# Altium schematic sheet ControllerSupplySwitch.SchDoc
size A4
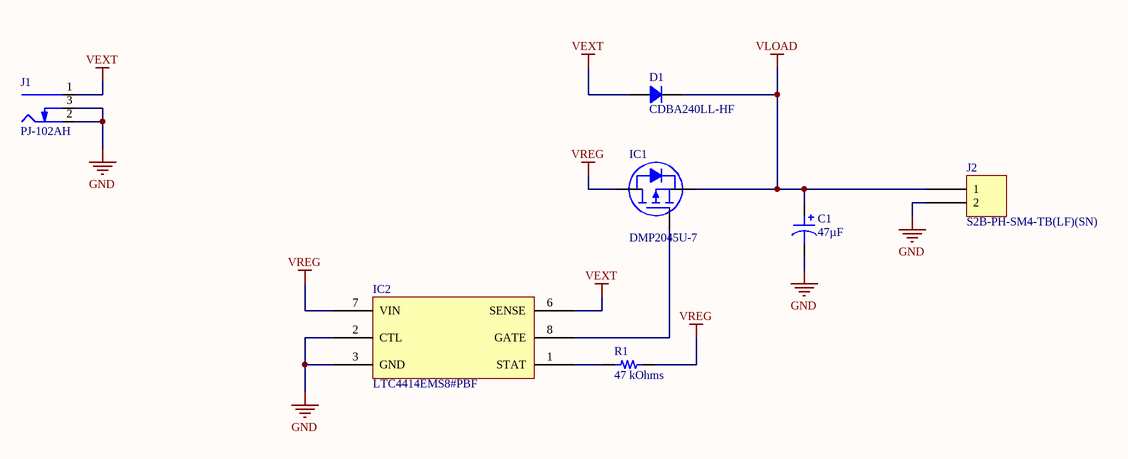
[diagram p0: ControllerSupplySwitch.SchDoc]

## Parts
C1  47µF  [CAP ALSMD 6.6MM H6.1MM]
D1  CDBA240LL-HF  [DO214AC SMA]
IC1  DMP2045U-7  [DIODES SOT-23-3]
IC2  LTC4414EMS8#PBF  [ANALOG MSOP-8 RM-8]
J1  PJ-102AH  [CUI PJ-102AH]
J2  S2B-PH-SM4-TB(LF)(SN)  [JST S2B-PH-SM4-TB]
R1  47 kOhms  [RES 0603_1608]

## Nets
GND: C1.2 IC2.2(CTL) IC2.3(GND) J1.2(Outer) J1.3(SW) J2.2
VEXT: D1.1 IC2.6(SENSE) J1.1(Centre)
VLOAD: C1.1 D1.2 IC1.2(S) J2.1
VREG: IC1.3(D) IC2.7(VIN) R1.2
NetIC1_1: IC1.1(G) IC2.8(GATE)
NetIC2_1: IC2.1(STAT) R1.1

## Notes on the sheet
- Title
- Size:
- Date:
- A4
- Number:
- Time:
- Revision:
- Sheet
- of
- File:

## Library data of the parts
C1 = HHXD250ARA470MF61G: ALUMINUM CAPACITOR; Manufacturer: United Chemi-Con; ESR (Equivalent Series Resistance): 50mOhm; Lifetime @ Temp.: 5000 Hrs @ 105°C; Ripple Current @ High Frequency: 1.3A @ 100kHz; Ripple Current @ Low Frequency: 130mA @ 120Hz; Surface Mount Land Size: 0.260" L x 0.260" W (6.60mm x 6.60mm); Tolerance: ±20%; Type: Hybrid; Voltage - Rated: 25V; Part Number: HHXD250ARA470MF61G; Applications: Automotive; Capacitance: 47µF; ComponentLink1Description: Datasheet; ComponentLink1URL: http://www.chemi-con.co.jp/cgi-bin/CAT_DB/SEARCH/cat_db_al.cgi?e=e&j=p&pdfname=hxd; ComponentLink2Description: DigiKey Link; ComponentLink2URL: http://digikey.com/product-detail/en/united-chemi-con/HHXD250ARA470MF61G/565-HHXD250ARA470MF61GCT-ND/10487166; Device Package: Radial, Can - SMD; Height - Seated (Max): 0.240" (6.10mm); LastUpdated: 21/01/2020 04:05:20; Lifecycle Status: Active; Minimum Order: 1; Mounting Type: Surface Mount; Operating Temperature: -55°C ~ 105°C; Package / Case: Radial, Can - SMD; Packaging: TapeAndReel; PartId: 2188; Part Status: Active; Price: 0.19; Ratings: AEC-Q200; Series: HXD; Size / Dimension: 0.248" Dia (6.30mm); Supplier 1: DigiKey; Supplier Part Number 1: 565-HHXD250ARA470MF61GCT-ND; Value: 47µF
D1 = CDBA240LL-HF: DIODE SCHOTTKY 40V 2A DO214AC; Manufacturer: Comchip Technology; Capacitance @ Vr, F: 160pF @ 4V, 1MHz; Current - Average Rectified (Io): 2A (DC); Current - Reverse Leakage @ Vr: 1mA @ 40V; Speed: Fast Recovery =< 500ns, > 200mA (Io); Voltage - Forward (Vf) (Max) @ If: 350mV @ 2A; Part Number: CDBA240LL-HF; ComponentLink1Description: Datasheet; ComponentLink1URL: http://www.comchiptech.com/admin/files/product/CDBA240LL-HF RevC514247.pdf; ComponentLink2Description: DigiKey Link; ComponentLink2URL: http://digikey.com/product-detail/en/comchip-technology/CDBA240LL-HF/641-1698-1-ND/5226081; Device Package: DO-214AC, SMA; Diode Type: Schottky; LastUpdated: 02/02/2020 10:17:39; Lifecycle Status: Active; Minimum Order: 1; Mounting Type: Surface Mount; Operating Temperature - Junction: -55°C ~ 100°C; Package / Case: DO-214AC, SMA; Packaging: TapeAndReel; PartId: 2082; Part Status: Active; Price: 0.15; Series: -; Supplier 1: DigiKey; Supplier Part Number 1: 641-1698-1-ND; Supplier Device Package: DO-214AC (SMA); Voltage - DC Reverse (Vr) (Max): 40V
IC1 = DMP2045U-7: MOSFET P-CHAN 24V SOT23; Manufacturer: Diodes Incorporated; Current - Continuous Drain (Id) @ 25°C: 4.3A (Ta); Drain to Source Voltage (Vdss): 20V; Drive Voltage (Max Rds On,  Min Rds On): 1.8V, 4.5V; FET Type: P-Channel; Gate Charge (Qg) (Max) @ Vgs: 6.8nC @ 4.5V; Input Capacitance (Ciss) (Max) @ Vds: 634pF @ 10V; Power Dissipation (Max): 800mW (Ta); Rds On (Max) @ Id, Vgs: 45mOhm @ 4A, 4.5V; Vgs (Max): ±8V; Vgs(th) (Max) @ Id: 1V @ 250µA; Part Number: DMP2045U-7; ComponentLink1Description: Datasheet; ComponentLink1URL: https://www.diodes.com/assets/Datasheets/DMP2045U.pdf; ComponentLink2Description: DigiKey Link; ComponentLink2URL: http://digikey.com/product-detail/en/diodes-incorporated/DMP2045U-7/DMP2045U-7DICT-ND/8275359; Device Package: TO-236-3, SC-59, SOT-23-3; LastUpdated: 21/01/2020 04:00:36; Lifecycle Status: Active; Minimum Order: 1; Mounting Type: Surface Mount; Operating Temperature: -55°C ~ 150°C (TJ); Package / Case: TO-236-3, SC-59, SOT-23-3; Packaging: TapeAndReel; Part Status: Active; Price: 0.08; Series: -; Supplier 1: DigiKey; Supplier Part Number 1: DMP2045U-7DICT-ND; Supplier Device Package: SOT-23; Technology: MOSFET (Metal Oxide)
IC2 = LTC4414EMS8#PBF: IC OR CTRLR SRC SELECT 8MSOP; Manufacturer: Linear Technology/Analog Devices; Current - Supply: 33µA; Delay Time - OFF: 20µs; Delay Time - ON: 600µs; FET Type: P-Channel; Internal Switch(s): No; Ratio - Input:Output: 2:1; Voltage - Supply: 3V ~ 36V; Applications: Battery Backup, Industrial/Automotive, High Current Switch; ComponentLink1Description: Datasheet; ComponentLink1URL: http://www.linear.com/docs/9037; ComponentLink2Description: DigiKey Link; ComponentLink2URL: http://digikey.com/product-detail/en/linear-technology-analog-devices/LTC4414EMS8-PBF/LTC4414EMS8-PBF-ND/1620230; Device Package: 8-TSSOP, 8-MSOP (0.118", 3.00mm Width); LastUpdated: 02/02/2020 11:30:26; Lifecycle Status: Active; Part Number: LTC4414EMS8#PBF; Minimum Order: 1; Mounting Type: Surface Mount; Operating Temperature: -40°C ~ 85°C; Package / Case: 8-TSSOP, 8-MSOP (0.118", 3.00mm Width); Packaging: Tube; Part Status: Active; Price: 4.49; Series: PowerPath™; Supplier 1: DigiKey; Supplier Part Number 1: LTC4414EMS8#PBF-ND; Supplier Device Package: 8-MSOP; Type: Source Selector Switch
J1 = PJ-102AH: CONN PWR JACK 2X5.5MM SOLDER; Manufacturer: CUI Devices; Actual Diameter: 0.079" (2.00mm ID), 0.256" (6.50mm OD); Current Rating (Amps): 5A; Gender: Male; Industry Recognized Mating Diameter: 2.00mm ID (0.079"), 5.50mm OD (0.217"); Internal Switch(s): Single Switch, Normally Closed; Material Flammability Rating: UL94 V-0; Mating Length/Depth: 0.354" (9.00mm); Number of Positions/Contacts: 2 Conductors, 3 Contacts; Shielding: Unshielded; Voltage - Rated: 24VDC; Part Number: PJ-102AH; ComponentLink1Description: Datasheet; ComponentLink1URL: https://www.cuidevices.com/product/resource/digikeypdf/pj-102ah.pdf; ComponentLink2Description: DigiKey Link; ComponentLink2URL: //digikey.com/product-detail/en/cui-devices/PJ-102AH/CP-102AH-ND/408448; Connector Type: Jack; LastUpdated: 16/12/2019 19:01:27; Lifecycle Status: 0; Minimum Order: 1; Mounting Type: Through Hole, Right Angle; Packaging: Tray; Part Status: Active; Price: 0.76; Series: -; Supplier 1: DigiKey; Supplier Part Number 1: CP-102AH-ND; Termination: Solder
J2 = S2B-PH-SM4-TB(LF)(SN): CONN HEADER SMD R/A 2POS 2MM; Manufacturer: JST Sales America Inc.; Contact Length - Mating: 0.130" (3.30mm); Current Rating (Amps): 2A; Material Flammability Rating: UL94 V-0; Number of Positions: 2; Number of Positions Loaded: All; Pitch - Mating: 0.079" (2.00mm); Shrouding: Shrouded - 4 Wall; Style: Board to Cable/Wire; Voltage Rating: 100V; Part Number: S2B-PH-SM4-TB(LF)(SN); ComponentLink1Description: Datasheet; ComponentLink1URL: http://www.jst-mfg.com/product/pdf/eng/ePH.pdf; ComponentLink2Description: DigiKey Link; ComponentLink2URL: http://digikey.com/product-detail/en/jst-sales-america-inc/S2B-PH-SM4-TB-LF-SN/455-1749-1-ND/926846; Connector Type: Header; Contact Finish - Mating: Tin; Contact Finish - Post: Tin; Contact Material: Copper Alloy; Contact Shape: Square; Contact Type: Male Pin; Fastening Type: Detent Lock; Features: Solder Retention; Insulation Color: Natural; Insulation Height: 0.217" (5.51mm); Insulation Material: Polyamide (PA6T), Nylon 6T; LastUpdated: 15/01/2020 03:45:11; Lifecycle Status: Active; Minimum Order: 1; Mounting Type: Surface Mount, Right Angle; Number of Rows: 1; Operating Temperature: -25°C ~ 85°C; Packaging: TapeAndReel; PartId: 115; Part Status: Active; Price: 0.27; Series: PH; Supplier 1: DigiKey; Supplier Part Number 1: 455-1749-1-ND; Termination: Solder
R1 = ERJ-PA3J473V: RES SMD 47K OHM 5% 1/4W 0603; Manufacturer: Panasonic Electronic Components; Power (Watts): 0.25W, 1/4W; Temperature Coefficient: ±200ppm/°C; Part Number: ERJ-PA3J473V; Value: 47 kOhms; ComponentLink1Description: Datasheet; ComponentLink1URL: https://industrial.panasonic.com/cdbs/www-data/pdf/RDO0000/AOA0000C331.pdf; ComponentLink2Description: DigiKey Link; ComponentLink2URL: http://digikey.com/product-detail/en/panasonic-electronic-components/ERJ-PA3J473V/P47KBZCT-ND/5036333; Composition: Thick Film; Device Package: 0603 (1608 Metric); Features: Automotive AEC-Q200, Pulse Withstanding; Height - Seated (Max): 0.022" (0.55mm); LastUpdated: 21/01/2020 00:18:33; Lifecycle Status: Active; Minimum Order: 1; Number of Terminations: 2; Operating Temperature: -55°C ~ 155°C; Package / Case: 0603 (1608 Metric); Packaging: TapeAndReel; PartId: 20573; Part Status: Active; Price: 0.01; Ratings: AEC-Q200; Resistance: 47 kOhms; Series: ERJ; Size / Dimension: 0.063" L x 0.031" W (1.60mm x 0.80mm); Supplier 1: DigiKey; Supplier Part Number 1: P47KBZCT-ND; Supplier Device Package: 0603; Tolerance: ±5%